# Altium schematic sheet UWB-IP-Hardware.SchDoc: UWB_IP_Hareware
size A4; Author: WangPeng; DrawnBy: WangPeng; Organization: IECAS; Revision: 1.0; SheetNumber: 1; SheetTotal: 1; ProjectName: Indoor Positioning
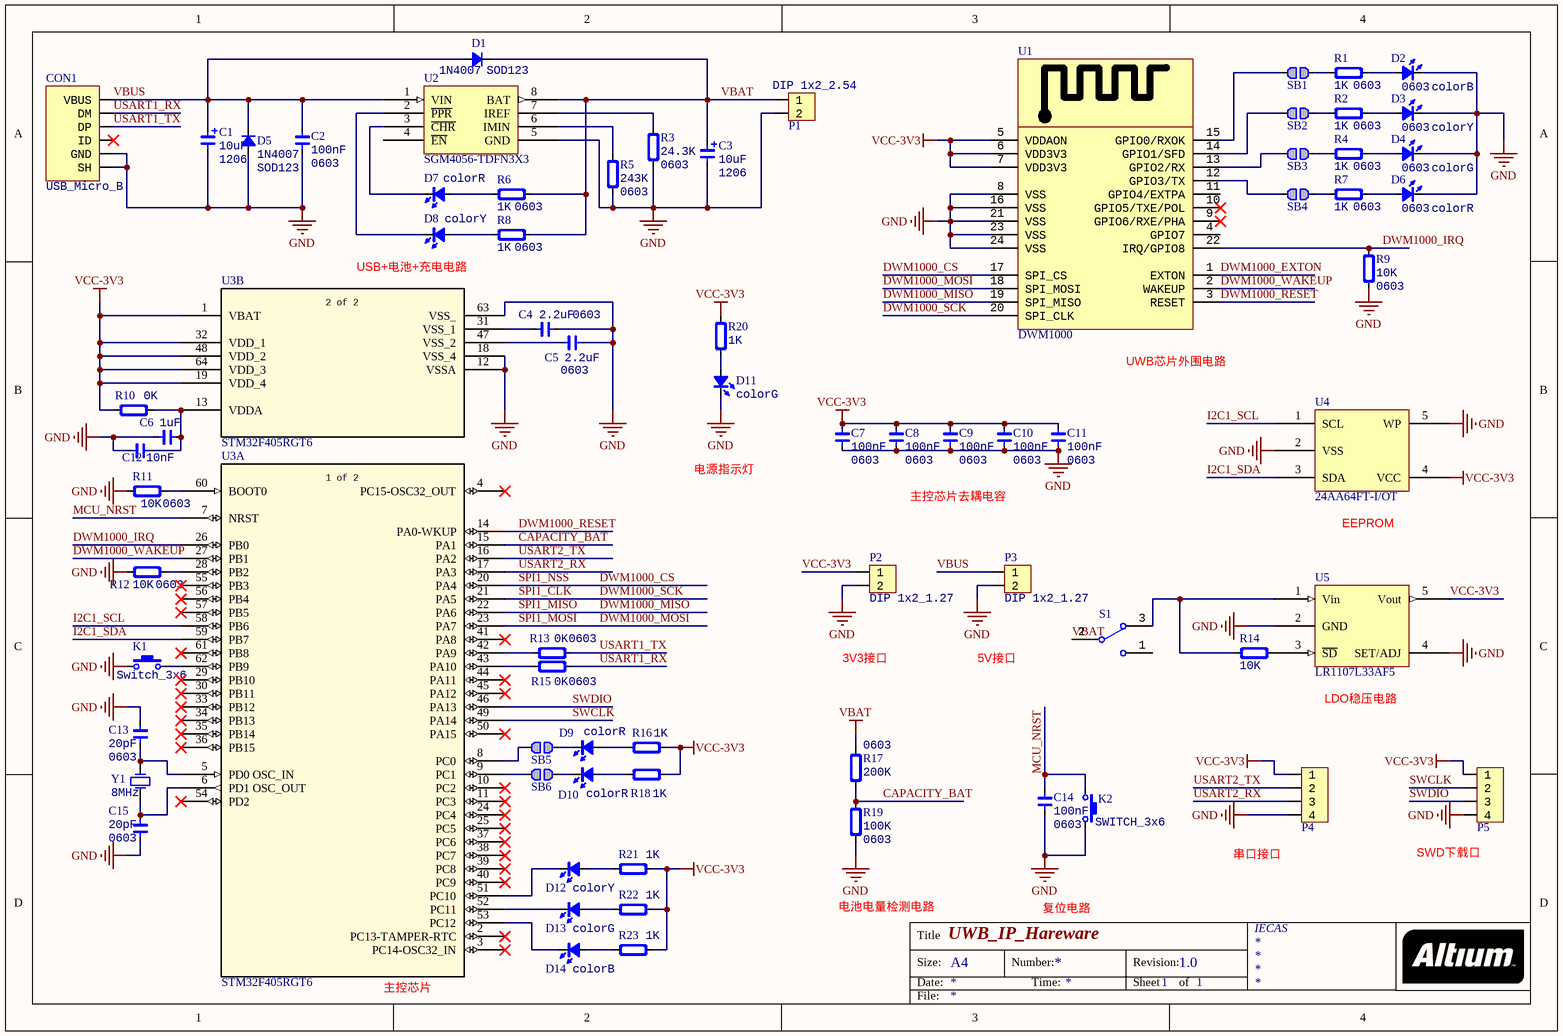
[diagram p0: UWB-IP-Hardware.SchDoc]

## Parts
C1  Type: 1206  [CAP_TAN_A1206]  (hidden comment: 10uF)
C2  Type: 0603  [CAP_0603]  (hidden comment: 100nF)
C3  Type: 1206  [CAP_TAN_A1206]  (hidden comment: 10uF)
C4  Type: 0603  [CAP_0603]  (hidden comment: 2.2uF)
C5  Type: 0603  [CAP_0603]  (hidden comment: 2.2uF)
C6  1uF  [CAP_0603]
C7  Type: 0603  [CAP_0603]  (hidden comment: 100nF)
C8  Type: 0603  [CAP_0603]  (hidden comment: 100nF)
C9  Type: 0603  [CAP_0603]  (hidden comment: 100nF)
C10  Type: 0603  [CAP_0603]  (hidden comment: 100nF)
C11  Type: 0603  [CAP_0603]  (hidden comment: 100nF)
C12  10nF  [CAP_0603]
C13  Type: 0603  [CAP_0603]  (hidden comment: 20pF)
C14  Type: 0603  [CAP_0603]  (hidden comment: 100nF)
C15  Type: 0603  [CAP_0603]  (hidden comment: 20pF)
CON1  USB_Micro_B  [USB_Micro-AB]
D1  Type: SOD123  [SOD-123]  (hidden comment: 1N4007)
D2  Type: 0603  [LED_0603_BLUE]  (hidden comment: colorB)
D3  Type: 0603  [LED_0603_YELLOW]  (hidden comment: colorY)
D4  Type: 0603  [LED_0603_GREEN]  (hidden comment: colorG)
D5  Type: SOD123  [SOD-123]  (hidden comment: 1N4007)
D6  Type: 0603  [LED_0603_RED]  (hidden comment: colorR)
D7  colorR  [LED_0603_RED]
D8  colorY  [LED_0603_YELLOW]
D9  colorR  [LED_0603_RED]
D10  colorR  [LED_0603_BLUE]
D11  colorG  [LED_0603_GREEN]
D12  colorY  [LED_0603_YELLOW]
D13  colorG  [LED_0603_GREEN]
D14  colorB  [LED_0603_BLUE]
K1  Switch_3x6  [ButtonTACT_3x6x2.5_180]
K2  SWITCH_3x6  [ButtonTACT_3x6x2.5_180]
P1  DIP 1x2_2.54  [HDR1X2_2.54_180]
P2  DIP 1x2_1.27  [HDR1X2_1.27_180]
P3  DIP 1x2_1.27  [HDR1X2_1.27_180]
P4  HDR1x4_2.54  [HDR1x4_2.54_180]  (value not drawn)
P5  HDR1x4_2.54  [HDR1x4_2.54_180]  (value not drawn)
R1  Type: 0603  [RES_0603]  (hidden comment: 1K)
R2  Type: 0603  [RES_0603]  (hidden comment: 1K)
R3  Type: 0603  [RES_0603]  (hidden comment: 24.3K)
R4  Type: 0603  [RES_0603]  (hidden comment: 1K)
R5  Type: 0603  [RES_0603]  (hidden comment: 243K)
R6  Type: 0603  [RES_0603]  (hidden comment: 1K)
R7  Type: 0603  [RES_0603]  (hidden comment: 1K)
R8  Type: 0603  [RES_0603]  (hidden comment: 1K)
R9  Type: 0603  [RES_0603]  (hidden comment: 10K)
R10  0K  [RES_0603]
R11  Type: 0603  [RES_0603]  (hidden comment: 10K)
R12  Type: 0603  [RES_0603]  (hidden comment: 10K)
R13  Type: 0603  [RES_0603]  (hidden comment: 0K)
R14  10K  [RES_0603]
R15  Type: 0603  [RES_0603]  (hidden comment: 0K)
R16  1K  [RES_0603]
R17  Type: 0603  [RES_0603]  (hidden comment: 200K)
R18  1K  [RES_0603]
R19  Type: 0603  [RES_0603]  (hidden comment: 100K)
R20  1K  [RES_0603]
R21  1K  [RES_0603]
R22  1K  [RES_0603]
R23  1K  [RES_0603]
S1  SPDT 3P  [SwitchSPDT_2.8X6.6_90]  (value not drawn)
SB1  Solderbridge  [Solderbridge]  (value not drawn)  (no BOM)
SB2  Solderbridge  [Solderbridge]  (value not drawn)  (no BOM)
SB3  Solderbridge  [Solderbridge]  (value not drawn)  (no BOM)
SB4  Solderbridge  [Solderbridge]  (value not drawn)  (no BOM)
SB5  Solderbridge  [Solderbridge]  (value not drawn)  (no BOM)
SB6  Solderbridge  [Solderbridge]  (value not drawn)  (no BOM)
U1  DWM1000  [DWM1000]
U2  SGM4056-TDFN3X3  [SGM4056-TDFN3X3-8L]
U3  STM32F405RGT6  [STM32F405RGT6-LQFP-64-M]  (parts A,B of 2)
U4  24AA64FT-I/OT  [EEPROM_24AA64FT-I/OT]
U5  LR1107L33AF5  [LR1107L33AF5]
Y1  8MHz  [XT_3225_2]

## Nets
GND: C1.2 C2.1 C3.2 C4.1 C5.1 C6.1 C7.1 C8.1 C9.1 C10.1 C11.1 C12.1 C13.2 C14.1 C15.1 CON1.0(SH) CON1.5(GND) D2.2(K) D3.2(K) D4.2(K) D5.1(A) D6.2(K) D11.2(K) K1.1 K2.2 P1.2 P2.2 P3.2 P4.4 P5.4 R3.1 R5.1 R9.1 R11.1 R12.1 R19.1 U1.8(VSS) U1.16(VSS) U1.21(VSS) U1.23(VSS) U1.24(VSS) U2.5(GND) U3.12(VSSA) U3.18(VSS_4) U3.63(VSS_) U4.2(VSS) U4.5(WP) U5.2(GND) U5.4(SET/ADJ)
VBAT: C3.1 D1.2(K) P1.1 R6.2 R8.2 R17.2 S1.2 U2.8(BAT)
VCC-3V3: C7.2 C8.2 C9.2 C10.2 C11.2 P2.1 P4.1 P5.1 R10.1 R16.2 R18.2 R20.1 R21.2 R22.2 R23.2 U1.5(VDDAON) U1.6(VDD3V3) U1.7(VDD3V3) U3.1(VBAT) U3.19(VDD_4) U3.32(VDD_1) U3.48(VDD_2) U3.64(VDD_3) U4.4(VCC) U5.5(Vout)
CAPACITY_BAT: R17.1 R19.2 U3.15(PA1)
DWM1000_CS: U1.17(SPI_CS) U3.20(PA4)  [also labelled SPI1_NSS]
DWM1000_EXTON: U1.1(EXTON)
DWM1000_IRQ: R9.2 U1.22(IRQ/GPIO8) U3.26(PB0)
DWM1000_MISO: U1.19(SPI_MISO) U3.22(PA6)  [also labelled SPI1_MISO]
DWM1000_MOSI: U1.18(SPI_MOSI) U3.23(PA7)  [also labelled SPI1_MOSI]
DWM1000_RESET: U1.3(RESET) U3.14(PA0-WKUP)
DWM1000_SCK: U1.20(SPI_CLK) U3.21(PA5)  [also labelled SPI1_CLK]
DWM1000_WAKEUP: U1.2(WAKEUP) U3.27(PB1)
I2C1_SCL: U3.58(PB6) U4.1(SCL)
I2C1_SDA: U3.59(PB7) U4.3(SDA)
MCU_NRST: C14.2 K2.1 U3.7(NRST)
SWCLK: P5.2 U3.49(PA14)
SWDIO: P5.3 U3.46(PA13)
USART1_RX: CON1.2(DM) R15.2
USART1_TX: CON1.3(DP) R13.2
USART2_RX: P4.3 U3.17(PA3)
USART2_TX: P4.2 U3.16(PA2)
VBUS: C1.1 C2.2 CON1.1(VBUS) D1.1(A) D5.2(K) P3.1 U2.1(VIN)
NetC4_2: C4.2 U3.31(VSS_1)
NetC5_2: C5.2 U3.47(VSS_2)
NetC6_2: C6.2 C12.2 R10.2 U3.13(VDDA)
NetC13_1: C13.1 U3.5(PD0_OSC_IN) Y1.2(OSC2)
NetC15_2: C15.2 U3.6(PD1_OSC_OUT) Y1.1(OSC1)
NetD2_1: D2.1(A) R1.2
NetD3_1: D3.1(A) R2.2
NetD4_1: D4.1(A) R4.2
NetD6_1: D6.1(A) R7.2
NetD7_1: D7.1(A) R6.1
NetD7_2: D7.2(K) U2.3(~{CHR})
NetD8_1: D8.1(A) R8.1
NetD8_2: D8.2(K) U2.2(~{PPR})
NetD9_1: D9.1(A) R16.1
NetD9_2: D9.2(K) SB5.2
NetD10_1: D10.1(A) R18.1
NetD10_2: D10.2(K) SB6.2
NetD11_1: D11.1(A) R20.2
NetD12_1: D12.1(A) R21.1
NetD12_2: D12.2(K) U3.51(PC10)
NetD13_1: D13.1(A) R22.1
NetD13_2: D13.2(K) U3.52(PC11)
NetD14_1: D14.1(A) R23.1
NetD14_2: D14.2(K) U3.53(PC12)
NetK1_2: K1.2 U3.62(PB9)
NetR1_1: R1.1 SB1.2
NetR2_1: R2.1 SB2.2
NetR3_2: R3.2 U2.7(IREF)
NetR4_1: R4.1 SB3.2
NetR5_2: R5.2 U2.6(IMIN)
NetR7_1: R7.1 SB4.2
NetR11_2: R11.2 U3.60(BOOT0)
NetR12_2: R12.2 U3.28(PB2)
NetR13_1: R13.1 U3.42(PA9)
NetR14_1: R14.1 S1.3 U5.1(Vin)
NetR14_2: R14.2 U5.3(~{SD})
NetR15_1: R15.1 U3.43(PA10)
NetSB1_1: SB1.1 U1.15(GPIO0/RXOK)
NetSB2_1: SB2.1 U1.14(GPIO1/SFD)
NetSB3_1: SB3.1 U1.13(GPIO2/RX)
NetSB4_1: SB4.1 U1.12(GPIO3/TX)
NetSB5_1: SB5.1 U3.8(PC0)
NetSB6_1: SB6.1 U3.9(PC1)

Not connected (* = marked no-connect by the designer): CON1 4(ID)*; S1 1; U1 4(GPIO7) 9(GPIO6/RXE/PHA)* 10(GPIO5/TXE/POL)* 11(GPIO4/EXTPA); U2 4(~{EN}); U3 2(PC13-TAMPER-RTC)* 3(PC14-OSC32_IN)* 4(PC15-OSC32_OUT)* 10(PC2)* 11(PC3)* 24(PC4)* 25(PC5)* 29(PB10)* 30(PB11)* 33(PB12)* 34(PB13)* 35(PB14)* 36(PB15)* 37(PC6)* 38(PC7)* 39(PC8)* 40(PC9)* 41(PA8)* 44(PA11)* 45(PA12)* 50(PA15)* 54(PD2)* 55(PB3)* 56(PB4)* 57(PB5)* 61(PB8)*

## Notes on the sheet
- USB+电池+充电电路
- (near U1) UWB芯片外围电路
- 电源指示灯
- 主控芯片去耦电容
- (near U4) EEPROM
- 3V3接口
- 5V接口
- (near U5) LDO稳压电路
- (near P5) SWD下载口
- 电池电量检测电路
- 复位电路
- 串口接口
- (near U3) 主控芯片
- Title
- Size:
- Date:
- A4
- Number:
- Time:
- Revision:
- Sheet
- of
- File:
- (in symbol STM32F405RGT6, part A) 1 of 2
- (in symbol STM32F405RGT6, part B) 2 of 2

## Library data of the parts
C1 C3 = Cap_Tan_1206: Capacitor Tantalum; Specification: X5R 10V; Manufacturer: *; Value: 10uF
C2 C4 C5 C7-C11 C13-C15 = Cap_0603: Capacitor; Specification: X7R 50V; Manufacturer: *
  C2 C7-C11 C14: Value: 100nF
  C4 C5: Value: 2.2uF
  C13 C15: Value: 20pF
C6 C12 = Cap_0603: Capacitor; Specification: X7R 50V; Type: 0603; Manufacturer: *
  C6: Value: 1uF
  C12: Value: 10nF
CON1 = USB_Micro: USB; Value: USB_Micro_B
D1 D5 = Diode_SOD123: Diode; Value: 1N4007
D2-D4 D6 = LED_0603: LED
  D2: Value: colorB
  D3: Value: colorY
  D4: Value: colorG
  D6: Value: colorR
D7-D14 = LED_0603: LED; Type: 0603
  D7 D9 D10: Value: colorR
  D8 D12: Value: colorY
  D11 D13: Value: colorG
  D14: Value: colorB
K1 K2 = ButtonTACT_3x6x2.5_180: Button; type: TACT 2P
  K1: value: Switch_3x6
  K2: value: SWITCH_3x6
P1 = HDR1x2_2.54: Header; Type: DIP 1x2; Value: DIP 1x2_2.54
P2 P3 = HDR1x2_1.27: Header; Value: DIP 1x2_1.27
  P2: Type: DIP 1x2_1.27
  P3: Type: DIP 1x2
P4 P5 = HDR1x4_2.54: Header
R1-R23 = Res_0603: Resistor; Specification: ±5%; Manufacturer: *
  R1 R2 R4 R6-R8: Value: 1K
  R3: Value: 24.3K
  R5: Value: 243K
  R9 R11 R12: Value: 10K
  R10: Value: 0K; Type: 0603
  R13 R15: Value: 0K
  R14: Value: 10K; Type: 0603
  R16 R18 R20-R23: Value: 1K; Type: 0603
  R17: Value: 200K
  R19: Value: 100K
S1 = SwitchSPDT_2.8x6.6_90: Switch; Value: SPDT 3P; Type: SPDT
U1 = DWM1000: Module; Manufacturer: Decawave Limited; Frequency: 3.5GHz ~ 6.5GHz; Data Rate: 6.8Mbps; Serial Interfaces: SPI; Antenna Type: Integrated, Chip; Voltage - Supply: 2.8 V ~ 3.6 V; Current - Receiving: 64mA; Current - Transmitting: 31mA; Supplier 1: Digi-Key; Manufacturer Part Number: DWM1000; RoHS: RoHS Compliant; Category: RF/IF and RFID; Stock 1: 1028; Pricing 1: 1=32.16, 10=26.704, 100=24.24, 250=22.51296 (USD); Packaging: Cut Tape (CT); RF Family/Standard: 802.15.4; Protocol: -; Modulation: -; Power - Output: -; Sensitivity: -; Memory Size: -; Mounting Type: Surface Mount; Operating Temperature: -40°C ~ 85°C; Package / Case: Module; ComponentLink1URL: http://www.decawave.com/sites/default/files/product-pdf/dwm1000-product-brief.pdf; ComponentLink1Description: http://www.decawave.com/sites/default/files/product-pdf/dwm1000-product-brief.pdf; Supplier Part Number 1: 1479-1002-1-ND
U2 = SGM4056: Value: SGM4056-TDFN3X3
U3 = STM32F405RGT6: No Description Available; Built_By: EMA_UL_Team; Vendor: STMicroelectronics; Manufacturer_Part_Number: STM32F405RGT6; Copyright: Copyright (C) 2018 Accelerated Designs. All rights reserved; RefDes: RefDes; Type: DEV; Value: Value
U4 = eeprom_24AA64FT-I/OT: Value: 24AA64FT-I/OT
U5 = LR1107/EL33AF5: Value: LR1107L33AF5
Y1 = XTAL_3225_2P: Crystal Oscillator; Value: 8MHz; Type: XTAL3225
SB1-SB6 = Solderbridge: Value: Solderbridge